# EAGLE design ME433_Breakout (EAGLE 9.6.2)
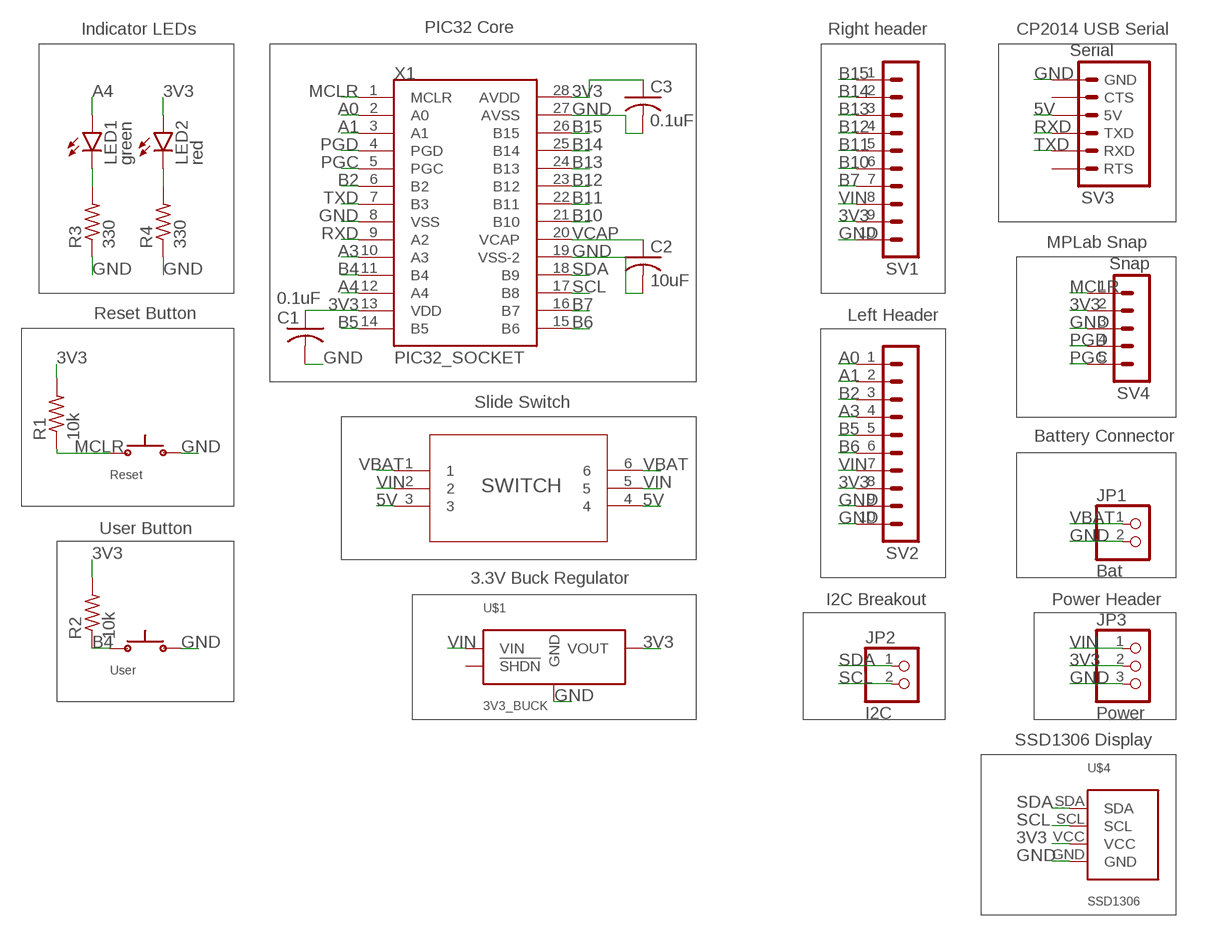
[diagram p0: schematic, sheet 1]

## Parts
C1  0.1uF  C-US025-025X050  [C025-025X050]
C2  10uF  C-US025-025X050  [C025-025X050]
C3  0.1uF  C-US025-025X050  [C025-025X050]
JP1  Bat  PINHD-1X2  [1X02]
JP2  I2C  PINHD-1X2  [1X02]
JP3  Power  PINHD-1X3  [1X03]
LED1  green  LED3MM  [LED3MM]
LED2  red  LED3MM  [LED3MM]
R1  10k  R-US_0207/10  [0207/10]
R2  10k  R-US_0207/10  [0207/10]
R3  330  R-US_0207/10  [0207/10]
R4  330  R-US_0207/10  [0207/10]
SV1  MA10-1  [MA10-1]
SV2  MA10-1  [MA10-1]
SV3  Serial  CP2014_BREAKOUT  [MA06-1]
SV4  Snap  MA05-1  [MA05-1]
U1  SWITCH  [SWITCH_011CQN]
U$1  3V3_BUCK  [3V3_BUCK]
U$2  Reset  PUSH_BUTTON  [PUSH_BUTTON]
U$3  User  PUSH_BUTTON  [PUSH_BUTTON]
U$4  SSD1306  [SSD1306]
X1  PIC32_SOCKET  [OST_ED281DT]

## Nets
3V3: C1.1 C3.1 JP3.2 LED2.A R1.2 R2.2 SV1.9 SV2.8 SV4.2 U$1.VOUT U$4.VCC X1.13(VDD) X1.28(AVDD)
5V: SV3.5V U1.3 U1.4
A0: SV2.1 X1.2(A0)
A1: SV2.2 X1.3(A1)
A3: SV2.4 X1.10(A3)
A4: LED1.A X1.12(A4)
B2: SV2.3 X1.6(B2)
B4: R2.1 U$3.P$1 X1.11(B4)
B5: SV2.5 X1.14(B5)
B6: SV2.6 X1.15(B6)
B7: SV1.7 X1.16(B7)
B10: SV1.6 X1.21(B10)
B11: SV1.5 X1.22(B11)
B12: SV1.4 X1.23(B12)
B13: SV1.3 X1.24(B13)
B14: SV1.2 X1.25(B14)
B15: SV1.1 X1.26(B15)
GND: C1.2 C2.2 C3.2 JP1.2 JP3.3 R3.1 R4.1 SV1.10 SV2.9 SV2.10 SV3.GND SV4.3 U$1.GND U$2.P$2 U$3.P$2 U$4.GND X1.8(VSS) X1.19(VSS-2) X1.27(AVSS)
MCLR: R1.1 SV4.1 U$2.P$1 X1.1(MCLR)
N$1: LED1.K(C) R3.2
N$2: LED2.K(C) R4.2
PGC: SV4.5 X1.5(PGC)
PGD: SV4.4 X1.4(PGD)
RXD: SV3.TXD X1.9(A2)
SCL: JP2.2 U$4.SCL X1.17(B8)
SDA: JP2.1 U$4.SDA X1.18(B9)
TXD: SV3.RXD X1.7(B3)
VBAT: JP1.1 U1.1 U1.6
VCAP: C2.1 X1.20(VCAP)
VIN: JP3.1 SV1.8 SV2.7 U1.2 U1.5 U$1.VIN
Unconnected: SV3.CTS SV3.RTS U$1.!SHDN

## Notes on the sheet
- Indicator LEDs | PIC32 Core | Right header | CP2014 USB Serial
- MPLab Snap
- Reset Button | Left Header
- Slide Switch
- Battery Connector
- User Button
- 3.3V Buck Regulator
- I2C Breakout | Power Header
- SSD1306 Display

## Library data of the parts
C1-C3 = rcl:C-US: CAPACITOR, American symbol; SPICEPREFIX: C
JP1 JP2 = pinhead:PINHD-1X2: PIN HEADER
JP3 = pinhead:PINHD-1X3: PIN HEADER
LED1 LED2 = led:LED: LED OSRAM: - CHIPLED LG R971, LG N971, LY N971, LG Q971, LY Q971, LO R971, LY R971 LH N974, LH R974 LS Q976, LO Q976, LY Q976 LO Q996 - Hyper CHIPLED LW Q18S LB Q993, LB Q99A, LB R99A - SideLED LS A670, LO A670, LY A670, LG A670, LP A670 LB A673, LV A673, LT A673, LW A673 LH A674 LY A675 LS A676, LA A676, LO A676, LY A676, LW A676 LS A679, LY A679, LG A679 - Hyper Micro SIDELED® LS Y876, LA Y876, LO Y876, LY Y876 LT Y87S - SmartLED LW L88C, LW L88S LB L89C, LB L89S, LG L890 LS L89K, LO L89K, LY L89K LS L896, LA L896, LO L896, LY L896 - TOPLED LS T670, LO T670, LY T670, LG T670, LP T670 LSG T670, LSP T670, LSY T670, LOP T670, LYG T670 LG T671, LOG T671, LSG T671 LB T673, LV T673, LT T673, LW T673 LH T674 LS T676, LA T676, LO T676, LY T676, LB T676, LH T676, LSB T676, LW T676 LB T67C, LV T67C, LT T67C, LS T67K, LO T67K, LY T67K, LW E67C LS E67B, LA E67B, LO E67B, LY E67B, LB E67C, LV E67C, LT E67C LW T67C LS T679, LY T679, LG T679 LS T770, LO T770, LY T770, LG T770, LP T770 LB T773, LV T773, LT T773, LW T773 LH T774 LS E675, LA E675, LY E675, LS T675 LS T776, LA T776, LO T776, LY T776, LB T776 LHGB T686 LT T68C, LB T68C - Hyper Mini TOPLED® LB M676 - Mini TOPLED Santana® LG M470 LS M47K, LO M47K, LY M47K Source: http://www.osram.convergy.de LUXEON: - LUMILED® LXK2-PW12-R00, LXK2-PW12-S00, LXK2-PW14-U00, LXK2-PW14-V00 LXK2-PM12-R00, LXK2-PM12-S00, LXK2-PM14-U00 LXK2-PE12-Q00, LXK2-PE12-R00, LXK2-PE12-S00, LXK2-PE14-T00, LXK2-PE14-U00 LXK2-PB12-K00, LXK2-PB12-L00, LXK2-PB12-M00, LXK2-PB14-N00, LXK2-PB14-P00, LXK2-PB14-Q00 LXK2-PR12-L00, LXK2-PR12-M00, LXK2-PR14-Q00, LXK2-PR14-R00 LXK2-PD12-Q00, LXK2-PD12-R00, LXK2-PD12-S00 LXK2-PH12-R00, LXK2-PH12-S00 LXK2-PL12-P00, LXK2-PL12-Q00, LXK2-PL12-R00 Source: www.luxeon.com KINGBRIGHT: KA-3528ASYC Source: www.kingbright.com
R1-R4 = rcl:R-US_: RESISTOR, American symbol; SPICEPREFIX: R
SV1 SV2 = con-lstb:MA10-1: PIN HEADER; OC_FARNELL: unknown; OC_NEWARK: unknown
SV3 = ME433_Breakout:CP2014_BREAKOUT: PIN HEADER; OC_FARNELL: unknown; OC_NEWARK: unknown
SV4 = con-lstb:MA05-1: PIN HEADER; OC_FARNELL: unknown; OC_NEWARK: unknown
U1 = ME433_Breakout:SWITCH; COPYRIGHT: Copyright (C) 2022 Ultra Librarian. All rights reserved.; DIGI-KEY_PART_NUMBER_1: 401-2001-ND; MANUFACTURER_PART_NUMBER: JS202011CQN; MFR_NAME: C&K
U$1 = ME433_Breakout:3V3_BUCK
U$2 U$3 = ME433_Breakout:PUSH_BUTTON
U$4 = ME433_Breakout:SSD1306
X1 = ME433_Breakout:PIC32_SOCKET: CONN IC DIP SOCKET 28POS TIN; DESCRIPTION: 28 (2 x 14) Pos DIP, 0.3 (7.62mm) Row Spacing Socket Tin Through Hole; DIGI-KEY_PART_NUMBER: ED3050-5-ND; MF: On Shore; MP: ED281DT; PACKAGE: None; PURCHASE-URL: https://pricing.snapeda.com/search/part/ED281DT/?ref=eda

## Board
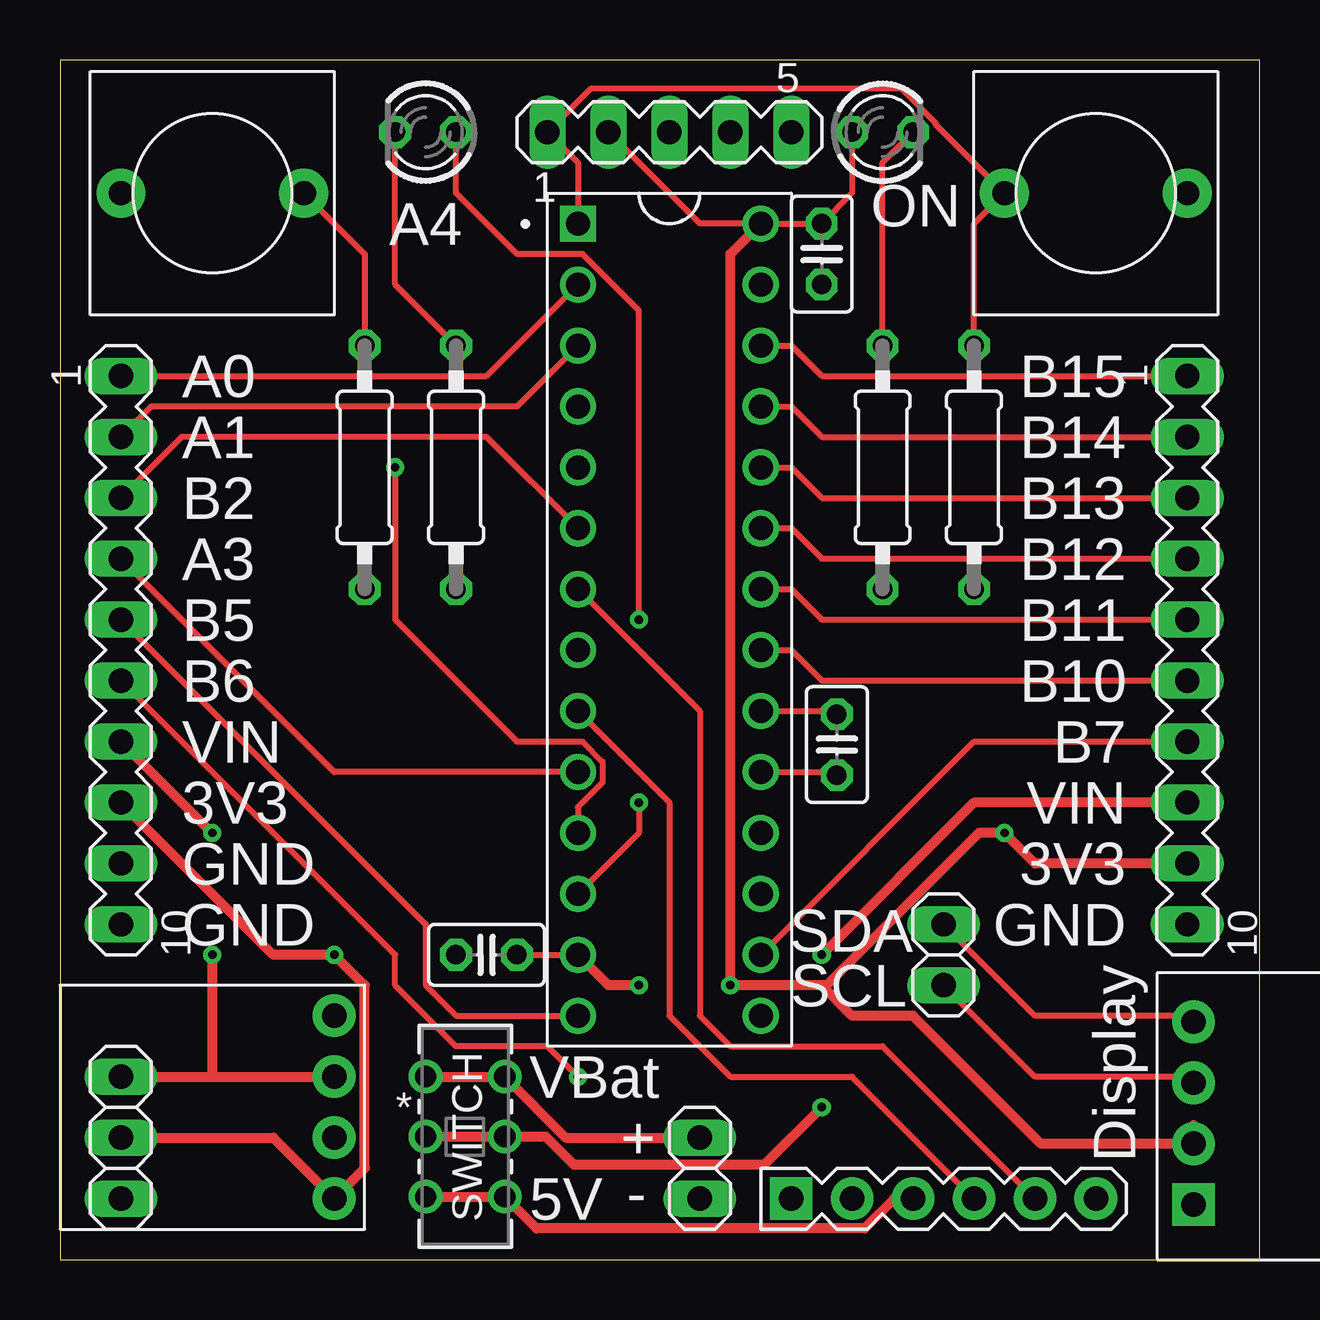
[diagram p1: board, top side]
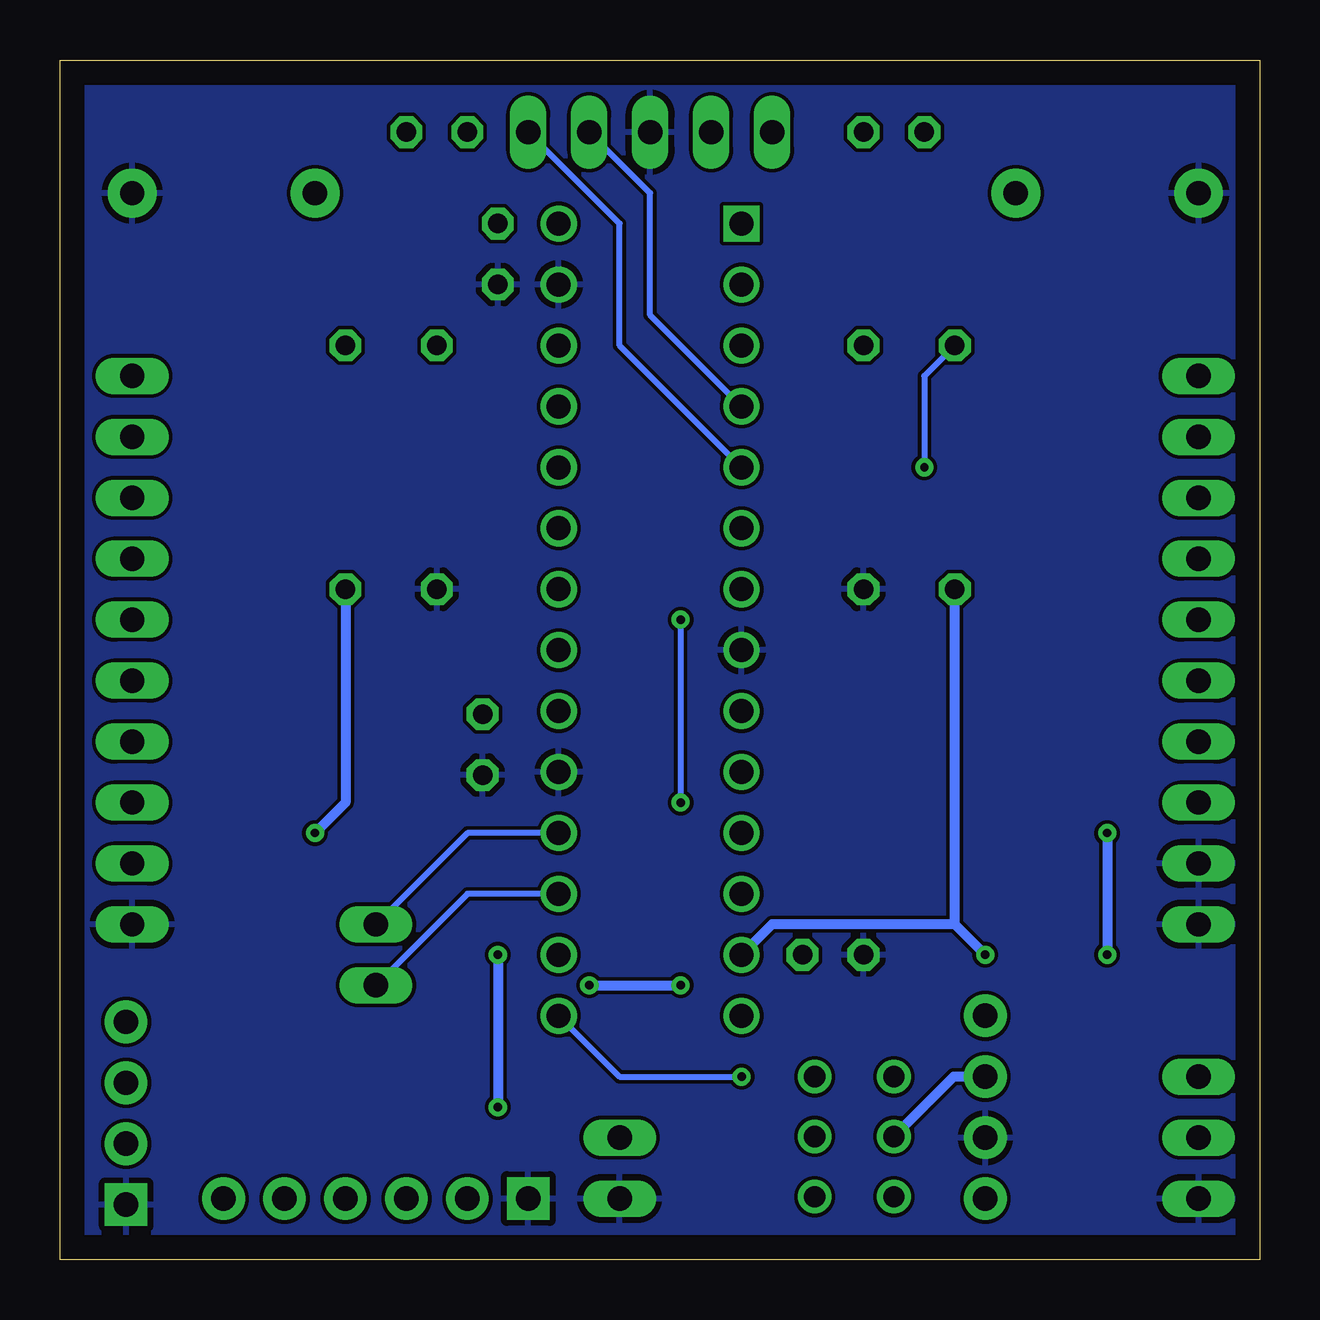
[diagram p2: board, bottom side, seen from below]

Size 50 x 50 mm. Coordinates in mm from the lower left corner, seen from the top.
Outline: 0,0 50,0 50,50 0,50 0,0
Copper layers (1*16): Top 0.035mm / dielectric 1.5mm / Bottom 0.035mm
Design rules "default": minimum track width 6mil, minimum drill 0.35mm, track to track 6mil, track to pad 6mil, pad to pad 6mil, via to via 6mil, smd to smd 6mil, copper to edge 40mil, drill to drill 6mil, minimum pad ring 10mil, minimum via ring 8mil, stop-mask expansion 4mil, vias tented up to drill 0mil, thermal gap 10mil

### Footprints (pad centres in the part's own frame; a part is rotated, then mirrored left to right if it is on the bottom)
C025-025X050 = drill 0.813 octagon: 1 -1.27,0; 2 1.27,0
1X02 = drill 1.016 long: 1 -1.27,0; 2 1.27,0
1X03 = drill 1.016 long: 1 -2.54,0; 2 0,0; 3 2.54,0
LED3MM = drill 0.813 octagon: A -1.27,0; K 1.27,0
0207/10 = drill 0.813 octagon: 1 -5.08,0; 2 5.08,0
MA10-1 = drill 1.016 long: 1 -11.43,0; 2 -8.89,0; 3 -6.35,0; 4 -3.81,0; 5 -1.27,0; 6 1.27,0; 7 3.81,0; 8 6.35,0; 9 8.89,0; 10 11.43,0
MA06-1 = drill 1.016 pad 1.778: 5V -1.27,0; CTS -3.81,0; RTS 6.35,0; RXD 3.81,0; TXD 1.27,0 | drill 1.016 pad 1.778 square: GND -6.35,0
MA05-1 = drill 1.016 long: 1 -5.08,0; 2 -2.54,0; 3 0,0; 4 2.54,0; 5 5.08,0
SWITCH_011CQN = drill 0.889 pad 1.397: 1 0,0; 2 0,-2.489; 3 0,-5.004; 4 3.302,-5.004; 5 3.302,-2.489; 6 3.302,0
3V3_BUCK = drill 1.016 pad 1.778: !SHDN 3.81,0; GND -1.27,0; VIN 1.27,0; VOUT -3.81,0
PUSH_BUTTON = drill 1.016 pad 2.032: P$1 -3.81,0; P$2 3.81,0
SSD1306 = drill 1.016 pad 1.778 square: GND 1.524,2.286 | drill 1.016 pad 1.778: SCL 1.524,7.366; SDA 1.524,9.906; VCC 1.524,4.826
OST_ED281DT = drill 1 square: 1 -3.81,16.51 | drill 1: 2 -3.81,13.97; 3 -3.81,11.43; 4 -3.81,8.89; 5 -3.81,6.35; 6 -3.81,3.81; 7 -3.81,1.27; 8 -3.81,-1.27; 9 -3.81,-3.81; 10 -3.81,-6.35; 11 -3.81,-8.89; 12 -3.81,-11.43; 13 -3.81,-13.97; 14 -3.81,-16.51; 15 3.81,-16.51; 16 3.81,-13.97; 17 3.81,-11.43; 18 3.81,-8.89; 19 3.81,-6.35; 20 3.81,-3.81; 21 3.81,-1.27; 22 3.81,1.27; 23 3.81,3.81; 24 3.81,6.35; 25 3.81,8.89; 26 3.81,11.43; 27 3.81,13.97; 28 3.81,16.51

### Placement (x,y rotation side)
C1  17.78,12.7 180 top
C2  32.38,21.46 270 top
C3  31.75,41.91 270 top
JP1  26.67,3.81 270 top
JP2  36.83,12.7 270 top
JP3  2.54,5.08 270 top
LED1  15.24,46.99 180 top
LED2  34.29,46.99 0 top
R1  38.1,33.02 270 top
R2  12.7,33.02 270 top
R3  16.51,33.02 90 top
R4  34.29,33.02 90 top
SV1  46.99,25.4 270 top
SV2  2.54,25.4 270 top
SV3  36.83,2.54 0 top
SV4  25.4,46.99 0 top
U1  15.24,7.62 0 top
U$1  11.43,6.35 90 top
U$2  43.18,44.45 0 top
U$3  6.35,44.45 180 top
U$4  45.72,0 0 top
X1  25.4,26.67 0 top

### Tracks (layer width: path | path; a pad name or v marks a point on that pad's centre or on a via)
3V3  (via drill 0.35)
  Top 0.254: C1.1 X1.13 | LED2.A 33.02,44.45 C3.1 X1.28 26.67,43.18 SV4.2
  Top 0.406: JP3.2 8.89,5.08 U$1.VOUT 12.7,3.81 12.7,11.43 v11.43,12.7 8.89,12.7 SV2.8 | 31.75,11.43 33.02,10.16 35.56,10.16 40.89,4.83 U$4.VCC 47.24,5.61 | 31.75,11.43 v27.94,11.43 27.94,41.91 X1.28 | v24.13,11.43 22.86,11.43 X1.13 | SV1.9 40.64,16.51 v39.37,17.78 38.3,17.78 31.95,11.43 31.75,11.43
  Bottom 0.406: v11.43,12.7 12.7,13.97 | 12.7,13.97 20.32,13.97 X1.13 | v27.94,11.43 v24.13,11.43 | 12.7,13.97 R2.2 | R1.2 38.1,19.05 v39.37,17.78
5V
  Top 0.406: SV3.5V 34.78,2.54 33.54,1.29 19.86,1.29 U1.4 U1.3
A0
  Top 0.254: SV2.1 17.78,36.83 X1.2
A1
  Top 0.254: SV2.2 3.81,35.56 19.05,35.56 X1.3
A3
  Top 0.254: SV2.4 11.43,20.32 X1.10
A4  (via drill 0.35)
  Top 0.254: v24.13,19.05 24.13,17.78 X1.12 | LED1.A 16.51,44.45 19.05,41.91 21.78,41.91 24.13,39.56 v24.13,26.67
  Bottom 0.254: v24.13,26.67 v24.13,19.05
B2
  Top 0.254: SV2.3 5.08,34.29 17.78,34.29 X1.6
B4  (via drill 0.35)
  Top 0.254: U$3.P$1 12.7,41.91 R2.1 | v13.97,33.02 13.97,26.67 19.05,21.59 21.78,21.59 22.62,20.75 22.62,19.89 21.59,18.86 X1.11
  Bottom 0.254: R2.1 13.97,36.83 v13.97,33.02
B5
  Top 0.254: SV2.5 15.24,13.97 15.24,11.43 16.51,10.16 X1.14
B6  (via drill 0.35)
  Top 0.254: v21.59,7.62 20.32,8.89 16.51,8.89 13.97,11.43 13.97,12.7 SV2.6
  Bottom 0.254: X1.15 26.67,7.62 v21.59,7.62
B7
  Top 0.254: X1.16 38.1,21.59 SV1.7
B10
  Top 0.254: X1.21 30.48,25.4 31.75,24.13 SV1.6
B11
  Top 0.254: X1.22 30.48,27.94 31.75,26.67 SV1.5
B12
  Top 0.254: X1.23 30.48,30.48 31.75,29.21 SV1.4
B13
  Top 0.254: X1.24 30.48,33.02 31.75,31.75 SV1.3
B14
  Top 0.254: X1.25 30.48,35.56 31.75,34.29 SV1.2
B15
  Top 0.254: X1.26 30.48,38.1 31.75,36.83 SV1.1
GND
  Top 0.254: X1.19 32.26,20.32 C2.2
  pour Bottom: 0,49.53 0,0 49.53,0 49.53,49.53
MCLR
  Top 0.254: X1.1 21.59,45.72 SV4.1 22.12,48.79 35.09,48.79 36.5,47.38 36.5,47.32 U$2.P$1 38.1,43.18 R1.1
N$1
  Top 0.254: R3.2 13.97,40.64 LED1.K
N$2
  Top 0.254: R4.2 34.29,45.72 LED2.K
PGC
  Bottom 0.254: X1.5 26.67,38.1 26.67,43.18 SV4.5
PGD
  Bottom 0.254: SV4.4 25.4,44.45 25.4,39.37 X1.4
RXD
  Top 0.254: X1.9 25.4,19.05 25.4,10.16 27.94,7.62 33.02,7.62 SV3.TXD
SCL
  Top 0.254: JP2.2 40.64,7.62 46.99,7.62 U$4.SCL
  Bottom 0.254: X1.17 33.02,15.24 JP2.2
SDA
  Top 0.254: JP2.1 40.64,10.16 46.99,10.16 U$4.SDA
  Bottom 0.254: X1.18 33.02,17.78 JP2.1
TXD
  Top 0.254: X1.7 26.67,22.86 26.67,10.16 27.94,8.89 34.29,8.89 SV3.RXD
VBAT
  Top 0.406: U1.1 U1.6 21.08,5.08 JP1.1
VCAP
  Top 0.254: X1.20 32.26,22.86 C2.1
VIN  (via drill 0.35)
  Top 0.406: JP3.1 6.35,7.62 | 6.35,7.62 U$1.VIN | U1.2 U1.5 20.24,5.13 21.41,3.96 29.36,3.96 v31.75,6.35 | SV2.7 v6.35,17.78 | v6.35,12.7 6.35,7.62 | v31.75,12.7 38.1,19.05 SV1.8
  Bottom 0.406: U$1.VIN 12.75,7.62 U1.2 | v6.35,17.78 v6.35,12.7 | v31.75,12.7 v31.75,6.35

### Text on the board
tPlace: ON | A4 | A0 | B15 | A1 | B14 | B2 | B13 | A3 | B12 | B5 | B11 | B6 | B10 | VIN | B7 | 3V3 | VIN | GND | 3V3 | GND | SDA | GND | SCL | VBat | + | Display | 5V | -